# Altium schematic sheet UI-User_Interface.SchDoc
size A4; SheetNumber: 2; SheetTotal: 3
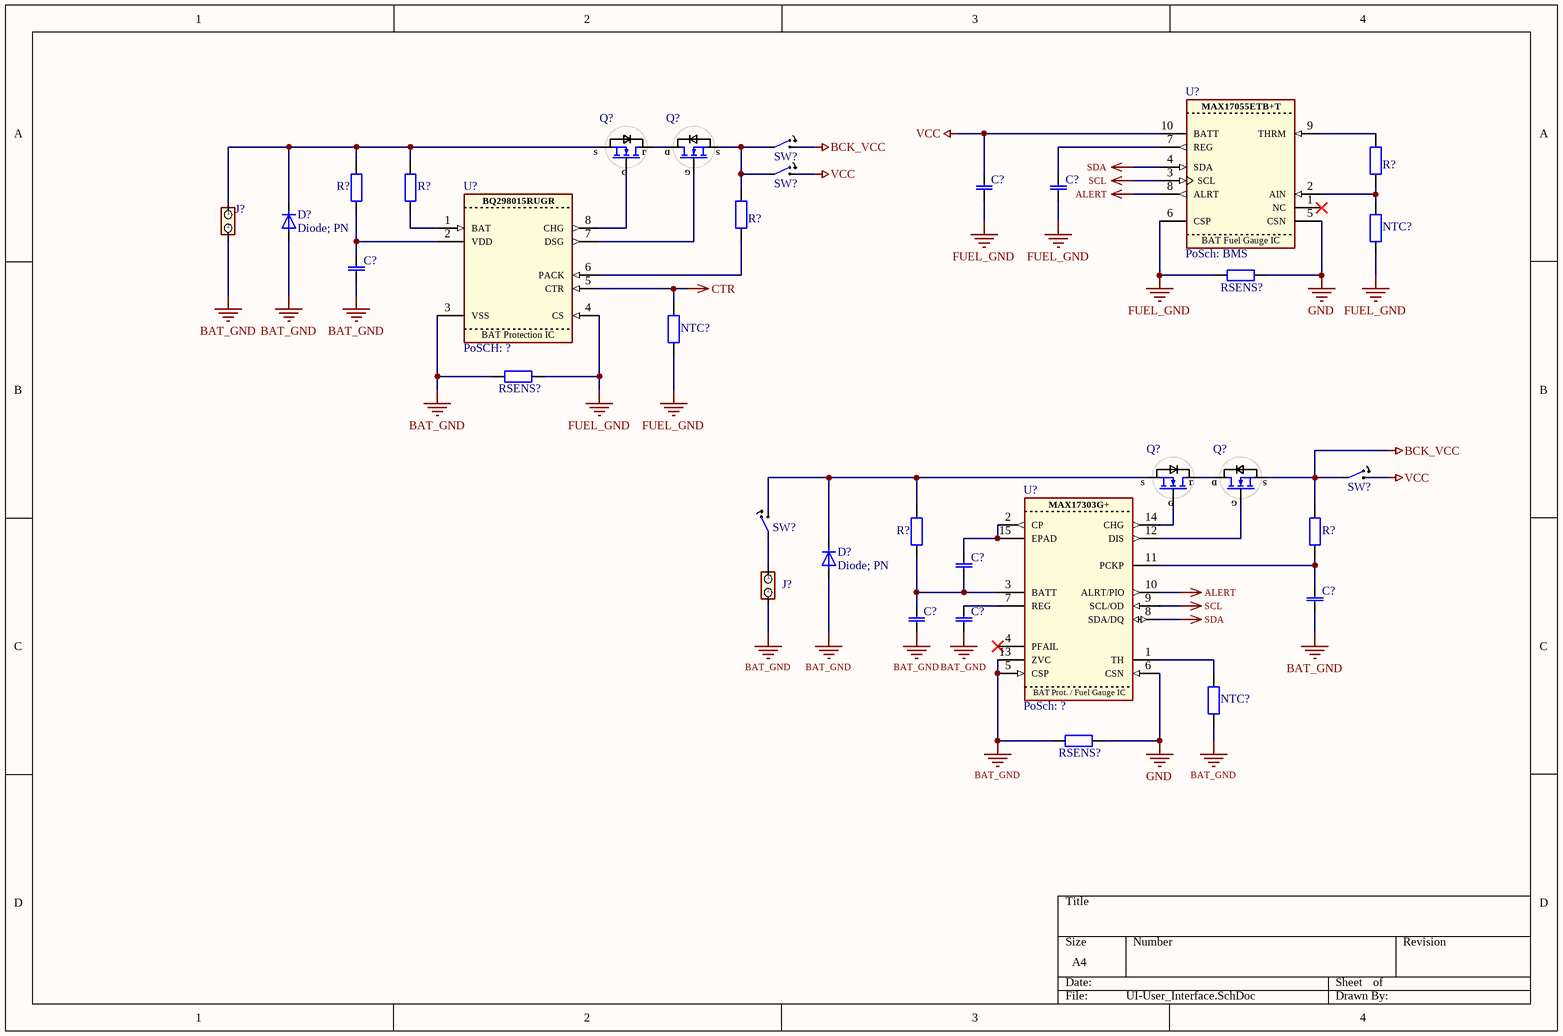
[diagram p0: UI-User_Interface.SchDoc]

## Parts
(Parts that share a designator on the sheet are numbered #1, #2 ... from top to bottom, then left to right.)
C?#1  Capacitor with no polarity  [CAPC340180_140N_KEM]  (value not drawn)
C?#2  Capacitor with no polarity  [CAPC340180_140N_KEM]  (value not drawn)
C?#3  Capacitor with no polarity  [CAPC340180_140N_KEM]  (value not drawn)
C?#4  Capacitor with no polarity  [CAPC340180_140N_KEM]  (value not drawn)
C?#5  Capacitor with no polarity  [CAPC340180_140N_KEM]  (value not drawn)
C?#6  Capacitor with no polarity  [CAPC340180_140N_KEM]  (value not drawn)
C?#7  Capacitor with no polarity  [CAPC340180_140N_KEM]  (value not drawn)
D?#1  Diode; PN
D?#2  Diode; PN
J?#1  PoSch: BMS  (value not drawn)
J?#2  PoSch: BMS  (value not drawn)
NTC?#1  Resistor of any value  [RESC3116X65N]  (value not drawn)
NTC?#2  Resistor of any value  [RESC3116X65N]  (value not drawn)
NTC?#3  Resistor of any value  [RESC3116X65N]  (value not drawn)
Q?#1  PoSch: BMS  (value not drawn)
Q?#2  PoSch: BMS  (value not drawn)
Q?#3  PoSch: BMS  (value not drawn)
Q?#4  PoSch: BMS  (value not drawn)
R?#1  Resistor of any value  [RESC3116X65N]  (value not drawn)
R?#2  Resistor of any value  [RESC3116X65N]  (value not drawn)
R?#3  Resistor of any value  [RESC3116X65N]  (value not drawn)
R?#4  Resistor of any value  [RESC3116X65N]  (value not drawn)
R?#5  Resistor of any value  [RESC3116X65N]  (value not drawn)
R?#6  Resistor of any value  [RESC3116X65N]  (value not drawn)
RSENS?#1  Resistor of any value  [RESC3116X65N]  (value not drawn)
RSENS?#2  Resistor of any value  [RESC3116X65N]  (value not drawn)
RSENS?#3  Resistor of any value  [RESC3116X65N]  (value not drawn)
SW?#1  PoSch: ?  (value not drawn)
SW?#2  PoSch: ?  (value not drawn)
SW?#3  PoSch: ?  (value not drawn)
SW?#4  PoSch: BMS  (value not drawn)
U?#1  PoSch: BMS  [BAT_FUEL_MAX17055ETB+T]
U?#2  PoSCH: ?  [BAT_PROT_BQ298015RUGR]
U?#3  PoSch: ?  [21-0137I_T1433-2_MXM]

## Nets
ALERT: U?#1.8(ALRT) U?#3.10(ALRT/PIO)
BAT_GND: C?#3.1 C?#5.1 C?#6.1 C?#7.1 D?#1.1(A) D?#2.1(A) J?#1.2(-) J?#2.2(-) NTC?#3.1 RSENS?#2.1 RSENS?#3.1 U?#2.3(VSS) U?#3.5(CSP) U?#3.13(ZVC)
BCK_VCC: Q?#4.1(D) R?#6.2 SW?#1.2 SW?#3.1
CTR: NTC?#2.2 U?#2.5(CTR)
FUEL_GND: C?#1.1 C?#2.1 NTC?#1.1 NTC?#2.1 RSENS?#1.1 RSENS?#2.2 U?#1.6(CSP) U?#2.4(CS)
GND: RSENS?#1.2 RSENS?#3.2 U?#1.5(CSN) U?#3.6(CSN)
SCL: U?#1.3(SCL) U?#3.9(SCL/OD)
SDA: U?#1.4(SDA) U?#3.8(SDA/DQ)
VCC: C?#1.2 SW?#2.2 SW?#3.2 U?#1.10(BATT)
NetC?#2_2: C?#2.2 U?#1.7(REG)
NetC?#3_2: C?#3.2 R?#2.1 U?#2.2(VDD)
NetC?#4_1: C?#4.1 C?#6.2 R?#5.1 U?#3.3(BATT)
NetC?#4_2: C?#4.2 U?#3.2(CP) U?#3.15(EPAD)
NetC?#5_2: C?#5.2 R?#6.1 U?#3.11(PCKP)
NetC?#7_2: C?#7.2 U?#3.7(REG)
NetD?#1_2: D?#1.2(K) J?#1.1(+) Q?#1.1(D) R?#2.2 R?#3.2
NetD?#2_2: D?#2.2(K) Q?#3.1(D) R?#5.2 SW?#4.2
NetJ?#2_1: J?#2.1(+) SW?#4.1
NetNTC?#1_2: NTC?#1.2 R?#1.1 U?#1.2(AIN)
NetNTC?#3_2: NTC?#3.2 U?#3.1(TH)
NetQ?#1_2: Q?#1.2(G) U?#2.8(CHG)
NetQ?#1_3: Q?#1.3(S) Q?#2.3(S)
NetQ?#2_1: Q?#2.1(D) R?#4.2 SW?#1.1 SW?#2.1
NetQ?#2_2: Q?#2.2(G) U?#2.7(DSG)
NetQ?#3_2: Q?#3.2(G) U?#3.14(CHG)
NetQ?#3_3: Q?#3.3(S) Q?#4.3(S)
NetQ?#4_2: Q?#4.2(G) U?#3.12(DIS)
NetR?#1_2: R?#1.2 U?#1.9(THRM)
NetR?#3_1: R?#3.1 U?#2.1(BAT)
NetR?#4_1: R?#4.1 U?#2.6(PACK)

Not connected (* = marked no-connect by the designer): U?#1 1(NC)*; U?#3 4(PFAIL)*

## Notes on the sheet
- (in symbol BAT_FUEL_MAX17055ETB+T) BAT Fuel Gauge IC
- (in symbol BAT_PROT+FUEL_MAX17303G+) BAT Prot. / Fuel Gauge IC
- (in symbol BAT_PROT_BQ298015RUGR) BQ298015RUGR; BAT Protection IC

## Library data of the parts
C?#1-C?#7 = CAP: This is an unpoled capacitor such as an ceramik or an Multi - Layer Cap. Put in here the description of your component.; Value: *
D?#1 D?#2 = Diode: Is used to block of current flow in one direction, Pay attetion to the maximum charactertcs
J?#1 J?#2 = CON2x1_vertical: PlugType: JST ''1.25mil; ComponentLink1Description: Datasheet Plug; ComponentLink1URL: *
NTC?#1-NTC?#3 R?#1-R?#6 RSENS?#1-RSENS?#3 = RES: Put in here the type and descriüption of your component; Value: *
Q?#1-Q?#4 = N-MOSFET: In this component, the parasitic diode is included because it plays an important rolw hen analysing networks; ComponentLink1Description: Datasheet; ComponentLink1URL: *
SW?#1-SW?#4 = Switch: 2 Postions (ON/OFF); ComponentLink1Description: Datasheet; ComponentLink1URL: *
U?#1 = BAT_FUEL_MAX17055ETB+T: MAX17055ETB+T, Battery Battery Monitor IC Multi-Chemistry 10-TDFN (2.5x2); MF: Maxim Integrated Products; Check_prices: https://www.snapeda.com/parts/MAX17055ETB+T/Maxim+Integrated/view-part/?ref=eda; Package: None; MP: MAX17055ETB+T; Case: 10-WFDFN mit freiliegendem Pad; Availability: In Stock; Purchase-URL: https://pricing.snapeda.com/search/part/MAX17055ETB+T/?ref=eda; SnapEDA_Link: https://www.snapeda.com/parts/MAX17055ETB+T/Maxim+Integrated/view-part/?ref=snap; Price: None; Supplier 1: Farnell; Supplier Part Number 1: MAX17055ETB+T; ComponentLink1Description: Datasheet; ComponentLink1URL: https://www.analog.com/media/en/technical-documentation/data-sheets/MAX17055.pdf
U?#2 = BAT_PROT_BQ298015RUGR: Battery Battery Protection IC Lithium Ion/Polymer 8-X2QFN (1.5x1.5); MF: NXP USA; MP: NT3H1101W0FHK; Package: XQFN-8 NXP Semiconductors; Price: None; Case: 8-X2QFN (1.5x1.5); SnapEDA_Link: https://www.snapeda.com/parts/NT3H1101W0FHK/NXP+USA+Inc./view-part/?ref=snap; Availability: Not in stock; Check_prices: https://www.snapeda.com/parts/NT3H1101W0FHK/NXP+USA+Inc./view-part/?ref=eda; ComponentLink1Description: Datasheet; ComponentLink1URL: https://www.ti.com/lit/ds/symlink/bq2980.pdf; Supplier 1: DigiKey; Supplier Part Number 1: 296-BQ298015RUGRCT-ND
U?#3 = BAT_PROT+FUEL_MAX17303G+: MAX17303G+; 1-Cell ModelGauge m5 EZ Fuel Gauge with Protector, Internal Self-Discharge Detection and SHA-256 Authentication; Manufacturer_Name: Analog Devices Inc; Copyright: Copyright (C) 2025 Ultra Librarian. All rights reserved.; Manufacturer_Part_Number: MAX17303G+; RefDes: RefDes; Type: Type; ComponentLink1Description: Datasheet; ComponentLink1URL: https://www.analog.com/media/en/technical-documentation/data-sheets/max17300-max17313.pdf; Case: 14-TDFN (3x3); Supplier 1: Farnell; Supplier Part Number 1: MAX17303G+